# EAGLE design RasPi-ADC_HAT v10 (EAGLE 8.2.2)
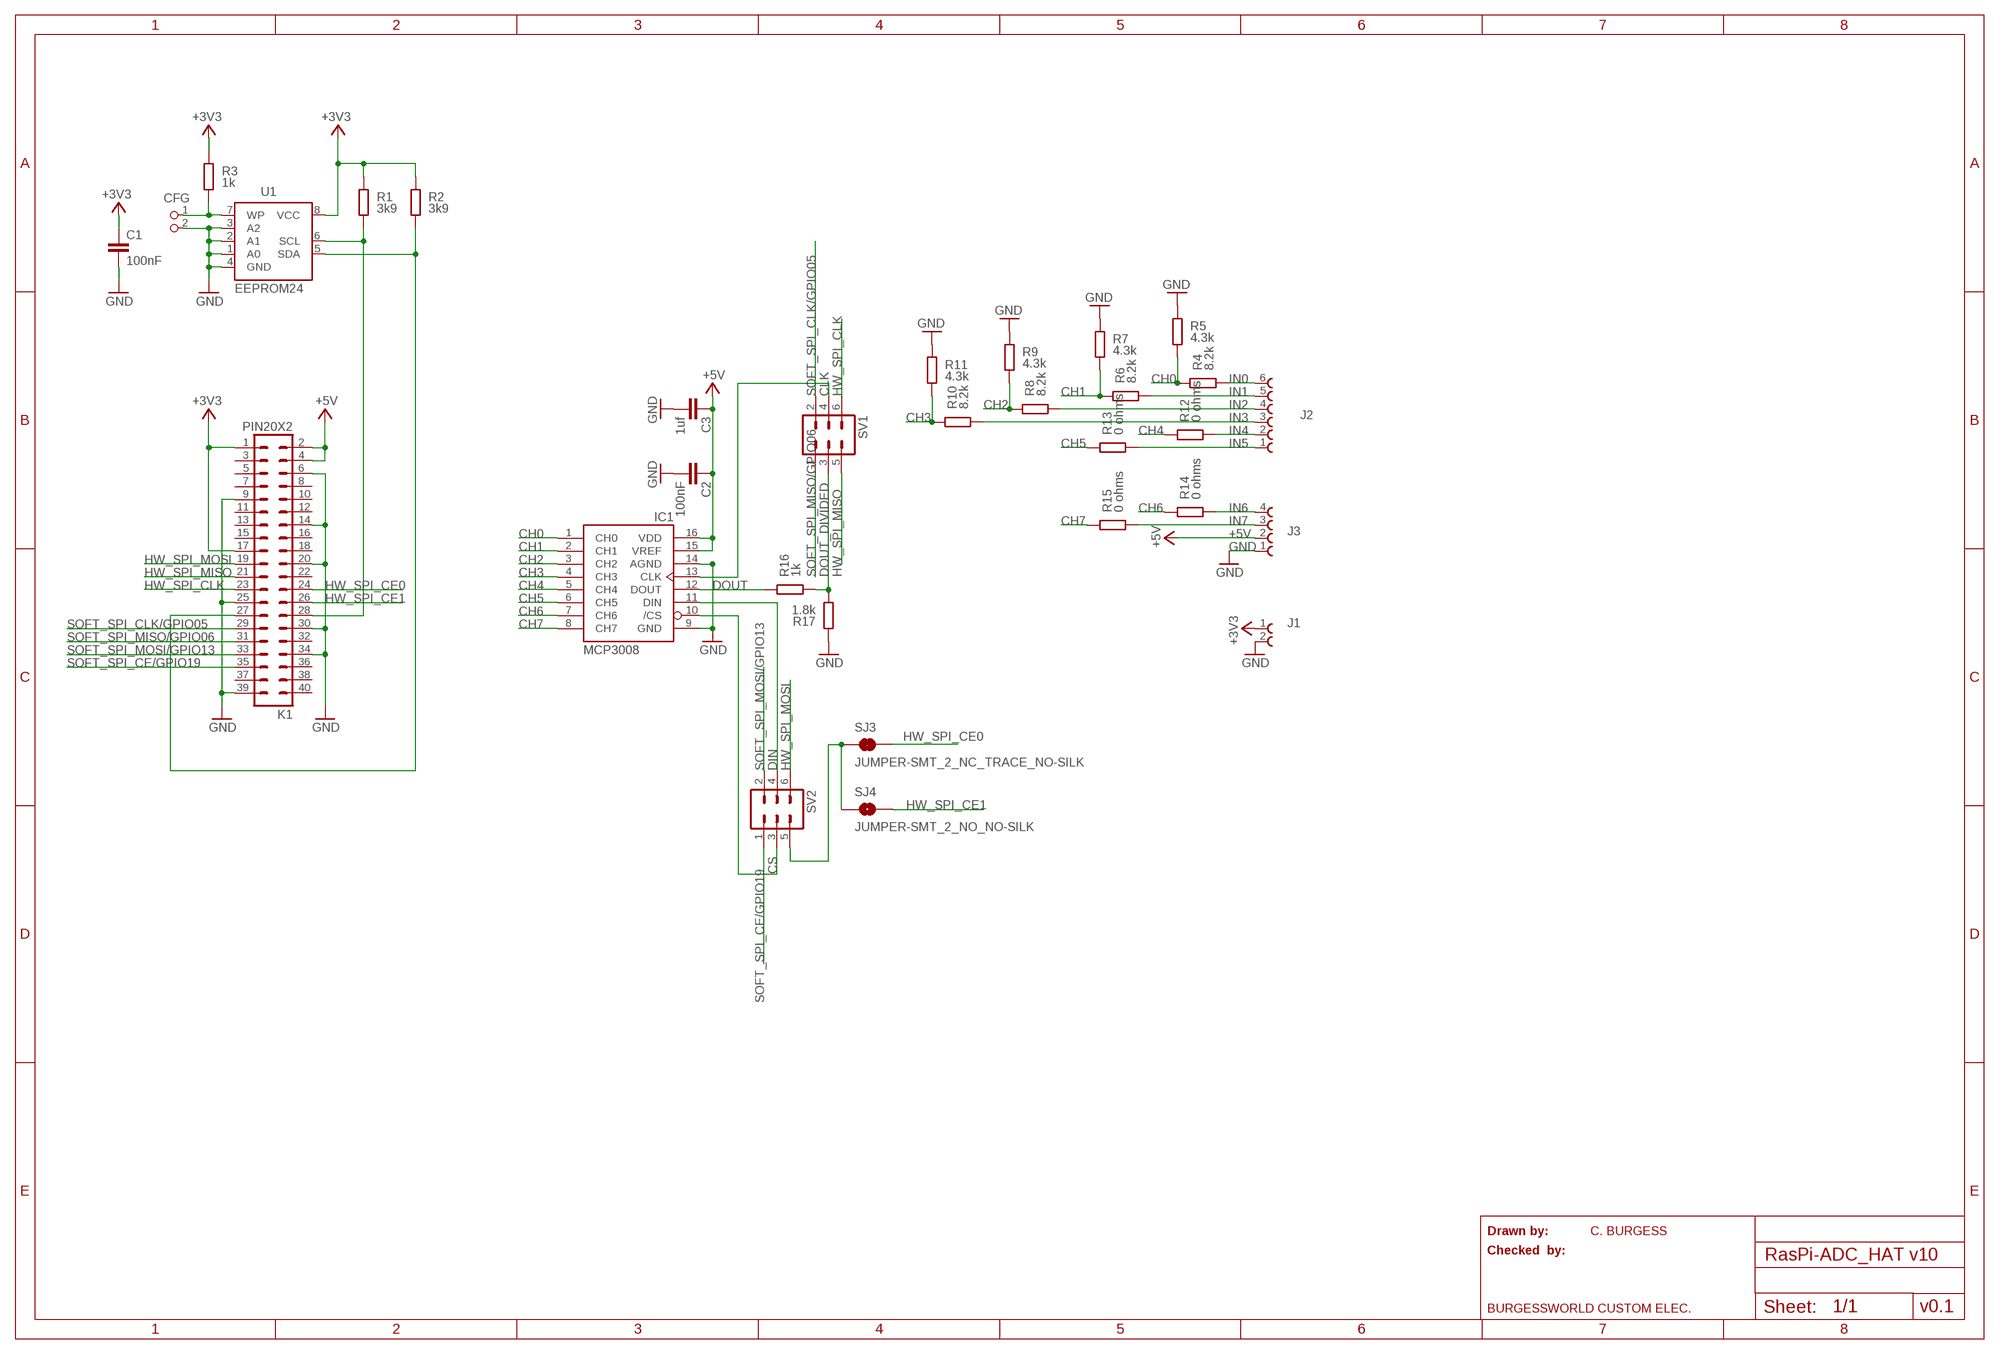
[diagram p0: schematic, sheet 1]

## Parts
C1  100nF  C-EUC0805K  [C0805K]
C2  100nF  C-EUC0805K  [C0805K]
C3  1uf  C-EUC0805K  [C0805K]
CFG  PIN2_100  [PIN_W_2]
IC1  MCP3008  [DIL16]
J1  691311500102  [691311500102]
J2  691311500106  [691311500106]
J3  691311500104  [691311500104]
K1  PIN20X2  [PIN_20X2]
R1  3k9  R-EU_M0805  [M0805]
R2  3k9  R-EU_M0805  [M0805]
R3  1k  R-EU_M0805  [M0805]
R4  8.2k  R-EU_M0805  [M0805]
R5  4.3k  R-EU_M0805  [M0805]
R6  8.2k  R-EU_M0805  [M0805]
R7  4.3k  R-EU_M0805  [M0805]
R8  8.2k  R-EU_M0805  [M0805]
R9  4.3k  R-EU_M0805  [M0805]
R10  8.2k  R-EU_M0805  [M0805]
R11  4.3k  R-EU_M0805  [M0805]
R12  0 ohms  R-EU_M0805  [M0805]
R13  0 ohms  R-EU_M0805  [M0805]
R14  0 ohms  R-EU_M0805  [M0805]
R15  0 ohms  R-EU_M0805  [M0805]
R16  1k  R-EU_M0805  [M0805]
R17  1.8k  R-EU_M0805  [M0805]
SJ3  JUMPER-SMT_2_NC_TRACE_NO-SILK  [SMT-JUMPER_2_NC_TRACE_NO-SILK]
SJ4  JUMPER-SMT_2_NO_NO-SILK  [SMT-JUMPER_2_NO_NO-SILK]
SV1  MA03-2  [MA03-2]
SV2  MA03-2  [MA03-2]
U1  EEPROM24  [SOIC8]

## Nets
+3V3: C1.1 J1.1 K1.1 K1.17 R1.2 R2.2 R3.2 U1.8(VCC)
+5V: C2.1 C3.1 IC1.15(VREF) IC1.16(VDD) J3.2 K1.2 K1.4
CH0: IC1.1(CH0) R4.2 R5.1
CH1: IC1.2(CH1) R6.2 R7.1
CH2: IC1.3(CH2) R8.2 R9.1
CH3: IC1.4(CH3) R10.2 R11.1
CH4: IC1.5(CH4) R12.2
CH5: IC1.6(CH5) R13.2
CH6: IC1.7(CH6) R14.2
CH7: IC1.8(CH7) R15.2
CLK: IC1.13(CLK) SV1.4
CS: IC1.10(/CS) SV2.3
DIN: IC1.11(DIN) SV2.4
DOUT: IC1.12(DOUT) R16.2
DOUT_DIVIDED: R16.1 R17.1 SV1.3
EEPROM_PROG: CFG.1 R3.1 U1.7(WP)
GND: C1.2 C2.2 C3.2 CFG.2 IC1.9(GND) IC1.14(AGND) J1.2 J3.1 K1.6 K1.9 K1.14 K1.20 K1.25 K1.30 K1.34 K1.39 R5.2 R7.2 R9.2 R11.2 R17.2 U1.1(A0) U1.2(A1) U1.3(A2) U1.4(GND)
HW_SPI_CE: SJ3.1 SJ4.1 SV2.5
HW_SPI_CE0: K1.24 SJ3.2
HW_SPI_CE1: K1.26 SJ4.2
HW_SPI_CLK: K1.23 SV1.6
HW_SPI_MISO: K1.21 SV1.5
HW_SPI_MOSI: K1.19 SV2.6
ID_SC_27: K1.27 R2.1 U1.5(SDA)
ID_SC_28: K1.28 R1.1 U1.6(SCL)
IN0: J2.6 R4.1
IN1: J2.5 R6.1
IN2: J2.4 R8.1
IN3: J2.3 R10.1
IN4: J2.2 R12.1
IN5: J2.1 R13.1
IN6: J3.4 R14.1
IN7: J3.3 R15.1
SOFT_SPI_CE/GPIO19: K1.35 SV2.1
SOFT_SPI_CLK/GPIO05: K1.29 SV1.2
SOFT_SPI_MISO/GPIO06: K1.31 SV1.1
SOFT_SPI_MOSI/GPIO13: K1.33 SV2.2
Unconnected: K1.3 K1.5 K1.7 K1.8 K1.10 K1.11 K1.12 K1.13 K1.15 K1.16 K1.18 K1.22 K1.32 K1.36 K1.37 K1.38 K1.40

## Notes on the sheet
- Drawn by: | C. BURGESS
- Checked  by:
- BURGESSWORLD CUSTOM ELEC. | v0.1

## Library data of the parts
C1-C3 = resistor:C-EU: CAPACITOR, European symbol; DIELECTRIC: X7R
CFG = FLYFISH:PIN2
IC1 = adafruit:MCP3008
J1 = Wurth_Elektronik_Electromechanic_Terminal_Blocks_Connectors_rev16e:691311500102: WR-TBL Serie 311 - 5.08 mm Close Vertical PCB Header , 2 Pins=>Code : Con_TBL_Pluggable_5.08_PCB_THT_Simple_V_691311500102 <http://katalog.we-online.de/media/images/eican/Con_TBL_Pluggable_5.08_PCB_THT_Simple_V_6913115001xx_pf2.jpg> Details see: http://katalog.we-online.de/en/em/TBL_5_08_311_CLOSE_VERTICAL_PCB_HEADER_6913115001XX Created 2014-06-23, Karrer Zheng 2014 (C) Würth Elektronik
J2 = Wurth_Elektronik_Electromechanic_Terminal_Blocks_Connectors_rev16e:691311500106: WR-TBL Serie 311 - 5.08 mm Close Vertical PCB Header , 6 Pins=>Code : Con_TBL_Pluggable_5.08_PCB_THT_Simple_V_691311500106 <http://katalog.we-online.de/media/images/eican/Con_TBL_Pluggable_5.08_PCB_THT_Simple_V_6913115001xx_pf2.jpg> Details see: http://katalog.we-online.de/en/em/TBL_5_08_311_CLOSE_VERTICAL_PCB_HEADER_6913115001XX Created 2014-06-23, Karrer Zheng 2014 (C) Würth Elektronik
J3 = Wurth_Elektronik_Electromechanic_Terminal_Blocks_Connectors_rev16e:691311500104: WR-TBL Serie 311 - 5.08 mm Close Vertical PCB Header , 4 Pins=>Code : Con_TBL_Pluggable_5.08_PCB_THT_Simple_V_691311500104 <http://katalog.we-online.de/media/images/eican/Con_TBL_Pluggable_5.08_PCB_THT_Simple_V_6913115001xx_pf2.jpg> Details see: http://katalog.we-online.de/en/em/TBL_5_08_311_CLOSE_VERTICAL_PCB_HEADER_6913115001XX Created 2014-06-23, Karrer Zheng 2014 (C) Würth Elektronik
K1 = FLYFISH:PIN20X2
R1-R17 = resistor:R-EU_: RESISTOR, European symbol; TOLERANCE: 5%
SJ3 = SparkFun-Jumpers:JUMPER-SMT_2_NC_TRACE: Normally closed trace jumper This jumper has a trace between two pads so it's normally closed (NC). Use a razor knife to open the connection. For best results follow the IPC guidelines for cutting traces: Cutout at least 0.063 mm (0.005 in). Remove all loose material to clean up the cut area. Seal the cut with an approved epoxy. Reapply solder to reclose the connection.
SJ4 = SparkFun-Jumpers:JUMPER-SMT_2_NO: Normally open jumper This jumper has two pads in close proximity to each other. Apply solder to close the connection. Round pads are easier to solder for beginners, but are a lot larger. SparkFun Product that uses the round pads: SparkFun EL Sequencer <https://www.sparkfun.com/products/12781>
SV1 SV2 = my-custom-lib:MA03-2: PIN HEADER; OC_FARNELL: unknown; OC_NEWARK: unknown
U1 = FLYFISH:EEPROM24

## Board
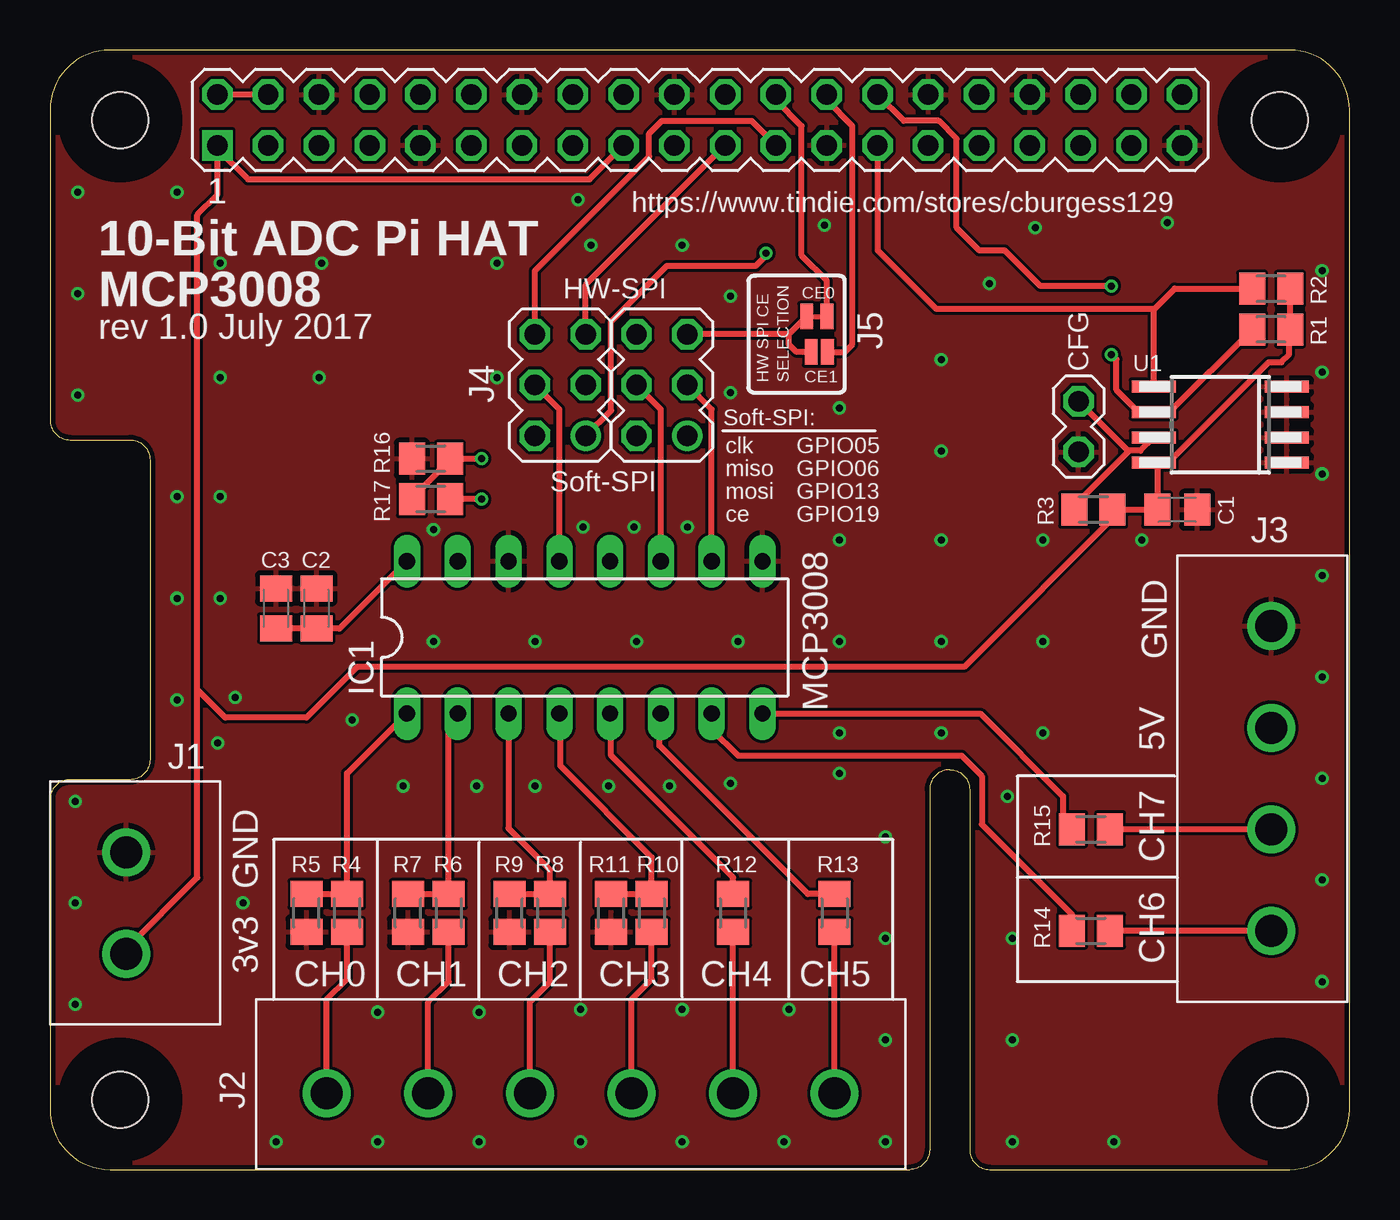
[diagram p1: board, top side]
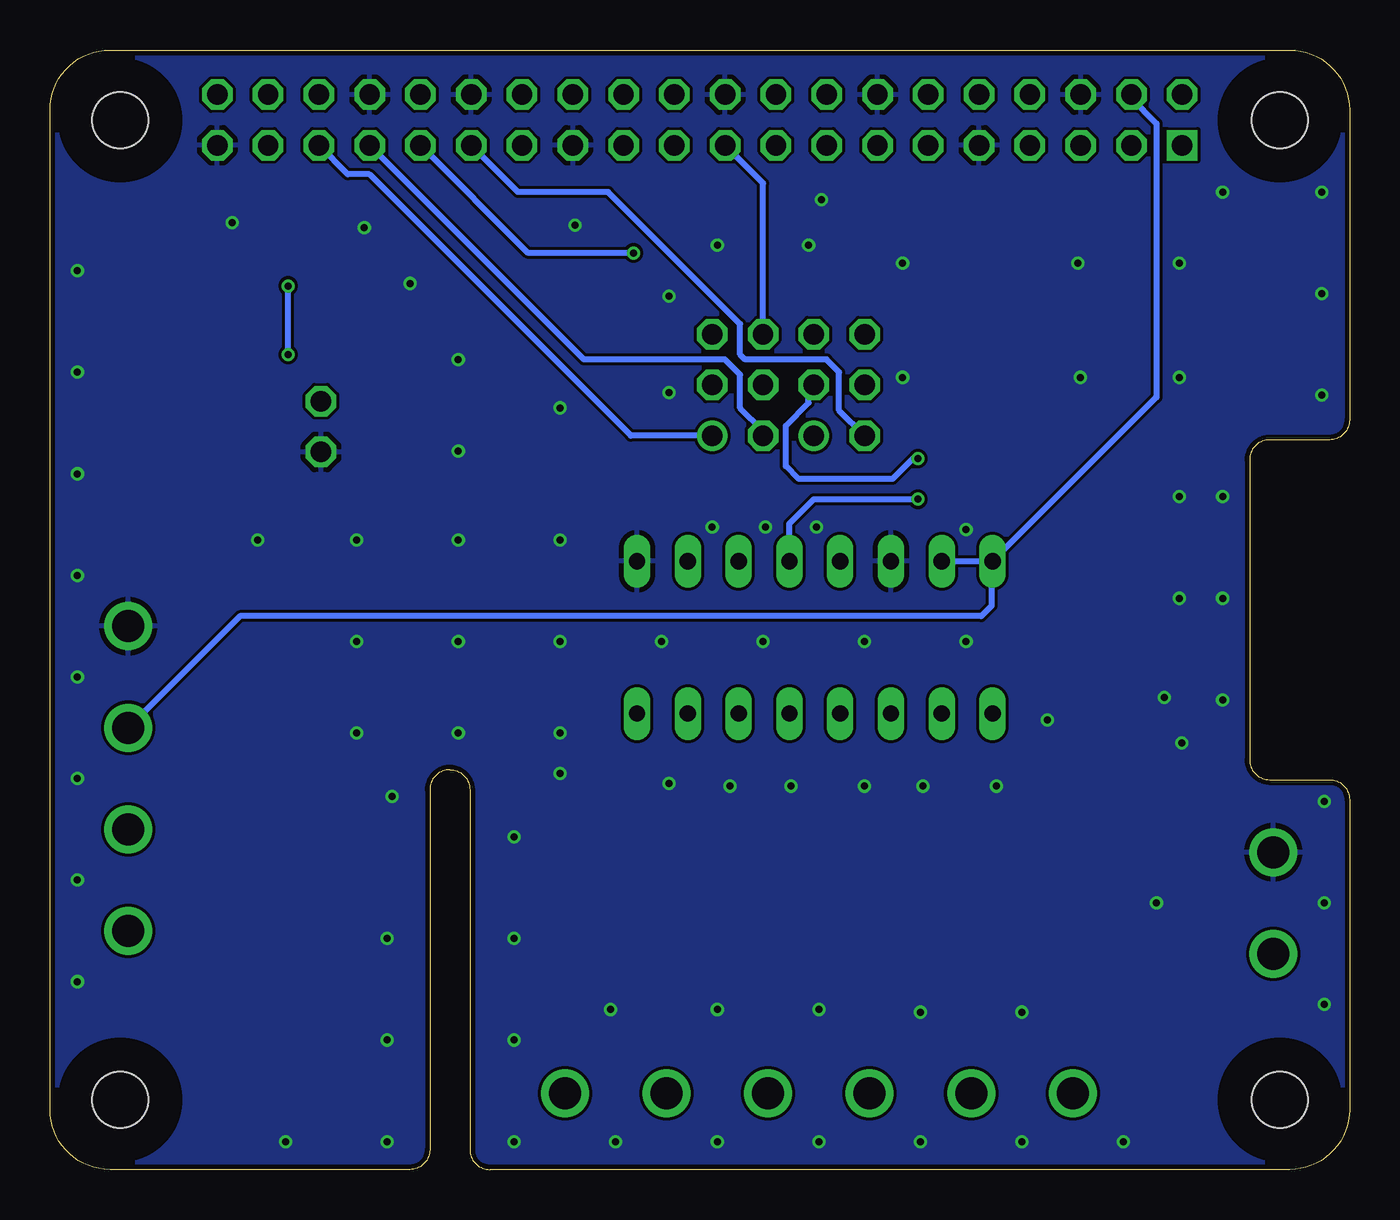
[diagram p2: board, bottom side, seen from below]

Size 65 x 56 mm. Coordinates in mm from the lower left corner, seen from the top.
Outline: 0,3 arc90 3,0 43,0 arc90 44,1 44,19 arc-90 45,20 arc-90 46,19 46,1 arc90 47,0 62,0 arc90 65,3 65,53 arc90 62,56 3,56 arc90 0,53 0,37.5 arc90 1,36.5 4,36.5 arc-90 5,35.5 5,20.5 arc-90 4,19.5 1,19.5 arc90 0,18.5 0,3
Copper layers (1*16): Top 0.035mm / dielectric 1.5mm / Bottom 0.035mm
Design rules "ITEADstudio_DRC": minimum track width 6mil, minimum drill 12mil, track to track 6mil, track to pad 6mil, pad to pad 6mil, via to via 6mil, smd to smd 0mil, copper to edge 10mil, drill to drill 10mil, minimum pad ring 10mil, minimum via ring 6mil, stop-mask expansion 2mil, vias tented up to drill 100mil, thermal gap 10mil
Holes 2.8 mm at 3.5,3.5 3.5,52.5 61.5,52.5 61.5,3.5
tRestrict: area 1.9,51 to 5,54; area 60,51 to 63,54; area 60,1.9 to 63,5; area 1.9,1.9 to 5,5
bRestrict: area 1.9,1.9 to 5,5; area 1.9,51 to 5,54; area 60,1.9 to 63,5; area 60,51 to 63,54

### Footprints (pad centres in the part's own frame; a part is rotated, then mirrored left to right if it is on the bottom)
C0805K = smd 1.3 x 1.6: 1 -1,0; 2 1,0
PIN_W_2 = drill 1.016 octagon: 1 0,0; 2 0,-2.54
DIL16 = drill 0.813 long: 1 -8.89,-3.81; 2 -6.35,-3.81; 3 -3.81,-3.81; 4 -1.27,-3.81; 5 1.27,-3.81; 6 3.81,-3.81; 7 6.35,-3.81; 8 8.89,-3.81; 9 8.89,3.81; 10 6.35,3.81; 11 3.81,3.81; 12 1.27,3.81; 13 -1.27,3.81; 14 -3.81,3.81; 15 -6.35,3.81; 16 -8.89,3.81
691311500102 = drill 1.6: 1 -2.54,0; 2 2.54,0
691311500106 = drill 1.6: 1 -12.7,0; 2 -7.62,0; 3 -2.54,0; 4 2.54,0; 5 7.62,0; 6 12.7,0
691311500104 = drill 1.6: 1 -7.62,0; 2 -2.54,0; 3 2.54,0; 4 7.62,0
PIN_20X2 = drill 1.016 square: 1 -24.13,-1.27 | drill 1.016 octagon: 2 -24.13,1.27; 3 -21.59,-1.27; 4 -21.59,1.27; 5 -19.05,-1.27; 6 -19.05,1.27; 7 -16.51,-1.27; 8 -16.51,1.27; 9 -13.97,-1.27; 10 -13.97,1.27; 11 -11.43,-1.27; 12 -11.43,1.27; 13 -8.89,-1.27; 14 -8.89,1.27; 15 -6.35,-1.27; 16 -6.35,1.27; 17 -3.81,-1.27; 18 -3.81,1.27; 19 -1.27,-1.27; 20 -1.27,1.27; 21 1.27,-1.27; 22 1.27,1.27; 23 3.81,-1.27; 24 3.81,1.27; 25 6.35,-1.27; 26 6.35,1.27; 27 8.89,-1.27; 28 8.89,1.27; 29 11.43,-1.27; 30 11.43,1.27; 31 13.97,-1.27; 32 13.97,1.27; 33 16.51,-1.27; 34 16.51,1.27; 35 19.05,-1.27; 36 19.05,1.27; 37 21.59,-1.27; 38 21.59,1.27; 39 24.13,-1.27; 40 24.13,1.27
M0805 = smd 1.3 x 1.6: 1 -0.95,0; 2 0.95,0
SMT-JUMPER_2_NC_TRACE_NO-SILK = smd 0.635 x 1.27: 1 -0.508,0; 2 0.508,0
SMT-JUMPER_2_NO_NO-SILK = smd 0.635 x 1.27: 1 -0.406,0; 2 0.406,0
MA03-2 = drill 1.016: 1 -2.54,-1.27 | drill 1.016 octagon: 2 -2.54,1.27; 3 0,-1.27; 4 0,1.27; 5 2.54,-1.27; 6 2.54,1.27
SOIC8 = smd 0.6 x 2.2: 1 -1.905,-3.33; 2 -0.635,-3.33; 3 0.635,-3.33; 4 1.905,-3.33; 5 1.905,3.33; 6 0.635,3.33; 7 -0.635,3.33; 8 -1.905,3.33

### Placement (x,y rotation side)
C1  56.38,33.01 0 top
C2  13.34,28.07 90 top
C3  11.3,28.07 90 top
CFG  51.45,38.43 0 top
IC1  26.75,26.62 0 top
J1  3.81,13.34 90 top
J2  26.54,3.81 180 top
J3  61.09,19.56 270 top
K1  32.5,52.5 0 top
R1  61.08,42.02 0 top
R2  61.08,44.05 0 top
R3  52.19,33.01 0 top
R4  14.86,12.83 90 top
R5  12.83,12.83 270 top
R6  19.94,12.83 90 top
R7  17.91,12.83 270 top
R8  25.02,12.83 90 top
R9  22.99,12.83 270 top
R10  30.1,12.83 90 top
R11  28.07,12.83 270 top
R12  34.16,12.83 90 top
R13  39.24,12.83 90 top
R14  52.07,11.94 180 top
R15  52.07,17.02 180 top
R16  19.05,33.53 0 top
R17  19.05,35.56 180 top
SJ3  38.35,42.67 0 top
SJ4  38.48,40.89 0 top
SV1  25.53,39.24 90 top
SV2  30.61,39.24 90 top
U1  58.53,37.26 90 top

### Tracks (layer width: path | path; a pad name or v marks a point on that pad's centre or on a via)
+3V3
  Top 0.305: 53.59,33.01 C1.1 55.38,35.18 U1.8 55.93,35.35 60.96,40.39 61.59,40.39 61.98,40.77 61.98,41.97 R1.2 R2.2 | 53.59,33.01 R3.2 | J1.1 3.81,11.05 7.37,14.61 7.37,24 | K1.17 26.99,49.53 9.91,49.53 8.37,51.07 K1.1 8.38,51.12 8.38,48.77 7.37,47.75 7.37,24 | 53.59,33.01 45.73,25.15 15.37,25.15 12.83,22.61 8.76,22.61 7.37,24
+5V
  Top 0.305: K1.4 K1.2 | IC1.16 14.48,27.05 13.35,27.05 C2.1 C3.1
  Bottom 0.305: J3.2 55.5,27.69 18.41,27.69 17.91,28.19 17.91,30.38 | 17.91,30.38 IC1.16 9.65,38.63 9.65,52.32 10.91,53.58 K1.4 | IC1.15 17.96,30.43 17.91,30.38
CH0
  Top 0.305: R5.1 R4.2 14.86,19.81 IC1.1
CH1
  Top 0.305: R7.1 R6.2 19.94,22.35 IC1.2
CH2
  Top 0.305: R9.1 R8.2 25.02,14.99 22.94,17.07 IC1.3
CH3
  Top 0.305: R11.1 R10.2 30.1,15.62 25.53,20.19 25.53,22.76 IC1.4
CH4
  Top 0.305: R12.2 34.16,14.61 28.07,20.7 28.07,22.76 IC1.5
CH5
  Top 0.305: R13.2 37.91,13.78 30.48,21.21 30.48,22.73 IC1.6
CH6
  Top 0.305: R14.2 51.12,12.76 46.61,17.27 46.61,19.68 45.59,20.7 34.42,20.7 33.1,22.02 IC1.7
CH7
  Top 0.305: IC1.8 46.53,22.81 50.67,18.67 50.67,17.08 R15.2
CLK
  Top 0.305: IC1.13 25.48,38.02 SV1.4
CS
  Top 0.305: IC1.10 33.1,38.02 SV2.3
DIN
  Top 0.305: IC1.11 30.56,38.02 SV2.4
DOUT  (via drill 0.35)
  Top 0.305: v21.59,33.53 R16.2
  Bottom 0.305: IC1.12 28.02,32.31 26.8,33.53 v21.59,33.53
DOUT_DIVIDED  (via drill 0.35)
  Top 0.305: v21.59,35.56 R17.1 20.32,35.24 20.32,35.05 20.19,34.92 19.43,34.92 18.1,33.59 R16.1
  Bottom 0.305: v21.59,35.56 21.84,35.56 22.86,34.54 27.56,34.54 28.19,35.18 28.19,37.21 27.05,38.35 27.05,38.99 SV1.3
EEPROM_PROG
  Top 0.305: 53.98,35.96 54.54,35.96 U1.7 | R3.1 51.25,33.02 51.25,33.23 53.98,35.96 | 53.98,35.96 53.92,35.96 CFG.1
GND  (via drill 0.35)
  other vias: 11.3,1.4 16.38,1.4 21.46,1.4 26.54,1.4 31.62,1.4 36.7,1.4 41.78,1.4 1.27,13.34 1.27,8.26 1.27,18.41 48.13,1.4 53.21,1.4 48.13,6.48 48.13,11.56 47.88,18.67 39.5,21.84 41.78,16.64 41.78,11.56 41.78,6.48 63.63,19.56 63.63,14.48 63.63,9.4 63.63,24.64 63.63,29.72 63.63,34.8 63.63,39.88 63.63,44.96 55.88,47.37 6.35,23.5 6.35,28.57 6.35,33.66 1.4,38.73 1.4,43.81 6.35,48.9 1.4,48.9 8.51,45.34 8.51,39.62 8.51,33.66 8.51,28.57 9.27,23.62 8.38,21.34 15.11,22.48 19.18,26.42 24.26,26.42 29.34,26.42 34.42,26.42 39.5,26.42 44.58,26.42 49.66,26.42 44.58,21.84 49.66,21.84 39.5,31.5 44.58,31.5 49.66,31.5 13.46,39.62 13.59,45.34 19.18,32 29.21,32.13 31.88,32.13 26.67,32.13 9.65,13.34 16.38,7.87 21.46,7.87 26.54,8 31.62,8 36.96,8 17.65,19.18 21.34,19.18 24.26,19.18 27.94,19.18 30.99,19.18 34.04,19.3 39.5,19.81 22.35,45.34 22.35,39.62 27.05,46.23 26.42,48.51 31.62,46.23 34.04,38.86 38.73,47.24 44.58,40.51 49.28,47.12 46.99,44.32 44.58,35.94 54.61,31.5 34.04,43.69 39.5,38.1
  pour Bottom: 0,3 arc90 3,0 43,0 arc90 44,1 44,19 arc-90 45,20 arc-90 46,19 46,1 arc90 47,0 62,0 arc90 65,3 65,53 arc90 62,56 3,56 arc90 0,53 0,37.5 arc90 1,36.5 4,36.5 arc-90 5,35.5 5,20.5 arc-90 4,19.5 1,19.5 arc90 0,18.5
  pour Top: 0,3 arc90 3,0 43,0 arc90 44,1 44,19 arc-90 45,20 arc-90 46,19 46,1 arc90 47,0 62,0 arc90 65,3 65,53 arc90 62,56 3,56 arc90 0,53 0,37.5 arc90 1,36.5 4,36.5 arc-90 5,35.5 5,20.5 arc-90 4,19.5 1,19.5 arc90 0,18.5
HW_SPI_CE
  Top 0.305: 36.96,41.78 SV2.5 | SJ4.1 37.34,40.89 36.96,41.27 36.96,41.78 | SJ3.1 36.96,41.78
HW_SPI_CE0
  Top 0.305: K1.24 36.31,53.48 37.59,52.2 37.59,45.72 38.86,44.45 SJ3.2
HW_SPI_CE1
  Top 0.305: K1.26 38.85,53.48 40.13,52.2 40.13,41.27 39.75,40.89 SJ4.2
HW_SPI_CLK
  Top 0.305: SV1.6 24.26,44.96 29.97,50.67 29.97,51.82 30.61,52.45 35.09,52.45 K1.23
HW_SPI_MISO
  Top 0.305: SV1.5 26.8,44.26 K1.21
HW_SPI_MOSI
  Bottom 0.305: SV2.6 29.34,49.34 K1.19
ID_SC_27
  Top 0.305: U1.5 55.2,43.01 | K1.27 41.39,45.99 44.32,43.05 55.16,43.05 55.2,43.01 | 55.2,43.01 56.26,44.07 60.11,44.07 R2.1
ID_SC_28  (via drill 0.35)
  Top 0.305: R1.1 56,37.9 U1.6 54.43,37.9 53.34,38.99 53.34,40.51 v53.09,40.77 | v53.09,44.2 49.53,44.2 47.75,45.97 46.48,45.97 45.34,47.12 45.34,51.56 44.45,52.45 42.71,52.45 K1.28
  Bottom 0.305: v53.09,40.77 v53.09,44.2
IN0
  Top 0.305: J2.6 13.84,8.51 14.86,9.53 R4.1
IN1
  Top 0.305: J2.5 18.92,8.38 19.94,9.4 R6.1
IN2
  Top 0.305: J2.4 24,8.38 25.02,9.4 R8.1
IN3
  Top 0.305: J2.3 29.08,8.51 30.1,9.53 R10.1
IN4
  Top 0.305: J2.2 R12.1
IN5
  Top 0.305: J2.1 R13.1
IN6
  Top 0.305: J3.4 R14.1
IN7
  Top 0.305: J3.3 R15.1
SOFT_SPI_CE/GPIO19
  Bottom 0.305: SV2.1 35.94,36.7 49.02,49.78 50.1,49.78 K1.35
SOFT_SPI_CLK/GPIO05
  Bottom 0.305: SV1.2 25.53,37.97 25.53,39.88 26.16,40.51 30.23,40.51 30.48,40.77 30.48,42.29 37.08,48.9 41.59,48.9 K1.29
SOFT_SPI_MISO/GPIO06  (via drill 0.35)
  Top 0.305: SV1.1 28.07,37.97 28.07,42.42 30.86,45.21 35.31,45.21 35.94,45.85 v35.81,45.85
  Bottom 0.305: v35.81,45.85 41.09,45.85 K1.31
SOFT_SPI_MOSI/GPIO13
  Bottom 0.305: SV2.2 29.34,36.96 30.48,38.1 30.48,39.75 31.24,40.51 38.29,40.51 K1.33

### Text on the board
tPlace: https://www.tindie.com/stores/cburgess129 | 10-Bit ADC Pi HAT | HW-SPI | MCP3008 | rev 1.0 July 2017 | HW SPI CE | SELECTION | Soft-SPI: | clk | GPIO05 | miso | GPIO06 | Soft-SPI | mosi | GPIO13 | ce | GPIO19
tNames: CE0 | J5 | CE1 | J4 | GND | 5V | GND | CH7 | 3v3 | CH6 | CH0 | CH1 | CH2 | CH3 | CH4 | CH5